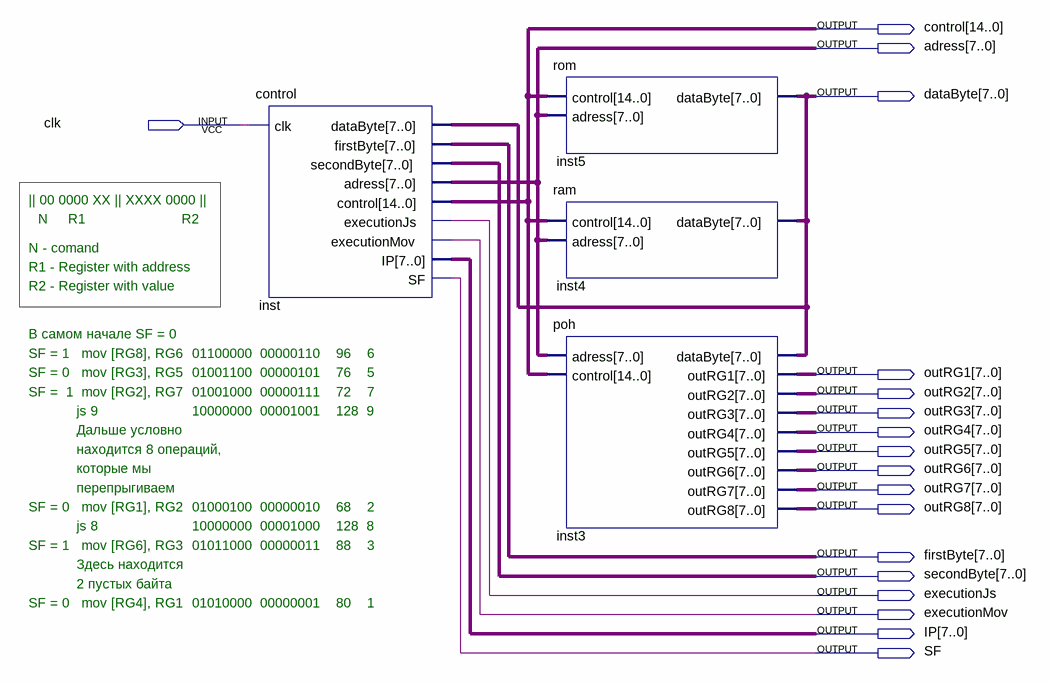
[diagram p0: schematic sheet]
// Quartus schematic Main.bdf as structural Verilog: 4 symbols, 18 pins
module Main (
  input  clk,
  output [14:0] control,
  output [7:0] adress,
  output [7:0] dataByte,
  output [7:0] outRG1,
  output [7:0] outRG2,
  output [7:0] outRG3,
  output [7:0] outRG4,
  output [7:0] outRG5,
  output [7:0] outRG6,
  output [7:0] outRG7,
  output [7:0] outRG8,
  output [7:0] firstByte,
  output [7:0] secondByte,
  output executionJs,
  output executionMov,
  output [7:0] IP,
  output SF
);

  control inst (
    .clk(clk), .firstByte(firstByte), .secondByte(secondByte), .adress(adress), .control(control),
    .executionJs(executionJs), .executionMov(executionMov), .IP(IP), .SF(SF), .dataByte(dataByte));
  rom inst5 (.control(control), .adress(adress), .dataByte(dataByte));
  ram inst4 (.control(control), .adress(adress), .dataByte(dataByte));
  poh inst3 (
    .adress(adress), .control(control), .outRG1(outRG1), .outRG2(outRG2), .outRG3(outRG3), .outRG4(outRG4),
    .outRG5(outRG5), .outRG6(outRG6), .outRG7(outRG7), .outRG8(outRG8), .dataByte(dataByte));

  // Notes on the sheet:
  //   || 00 0000 XX || XXXX 0000 ||
  //   N     R1                        R2
  //   N - comand
  //   R1 - Register with address
  //   R2 - Register with value
  //   В самом начале SF = 0
  //   SF = 1   mov [RG8], RG6
  //   01100000  00000110
  //   96    6
  //   SF = 0   mov [RG3], RG5
  //   01001100  00000101
  //   76    5
  //   SF =  1  mov [RG2], RG7
  //   01001000  00000111
  //   72    7
  //   js 9
  //   10000000  00001001
  //   128  9
  //   Дальше условно
  //   находится 8 операций,
  //   которые мы
  //   перепрыгиваем
  //   SF = 0   mov [RG1], RG2
  //   01000100  00000010
  //   68    2
  //   js 8
  //   10000000  00001000
  //   128  8
  //   SF = 1   mov [RG6], RG3
  //   01011000  00000011
  //   88    3
  //   Здесь находится
  //   2 пустых байта
  //   SF = 0   mov [RG4], RG1
  //   01010000  00000001
  //   80    1
endmodule
